# Altium schematic sheet Sheet2.SchDoc
size 420 x 297 mm; Razrabotal: {Разработал}; Prov: {Проверил}; Tkont: {Т. конт.}; Nkont: {Н. конт.}; Utv: {Утвердил}; Naimenovanie: {Наименование}; Oboznachenie: {Обозначение}; Shifr: {Шифр}
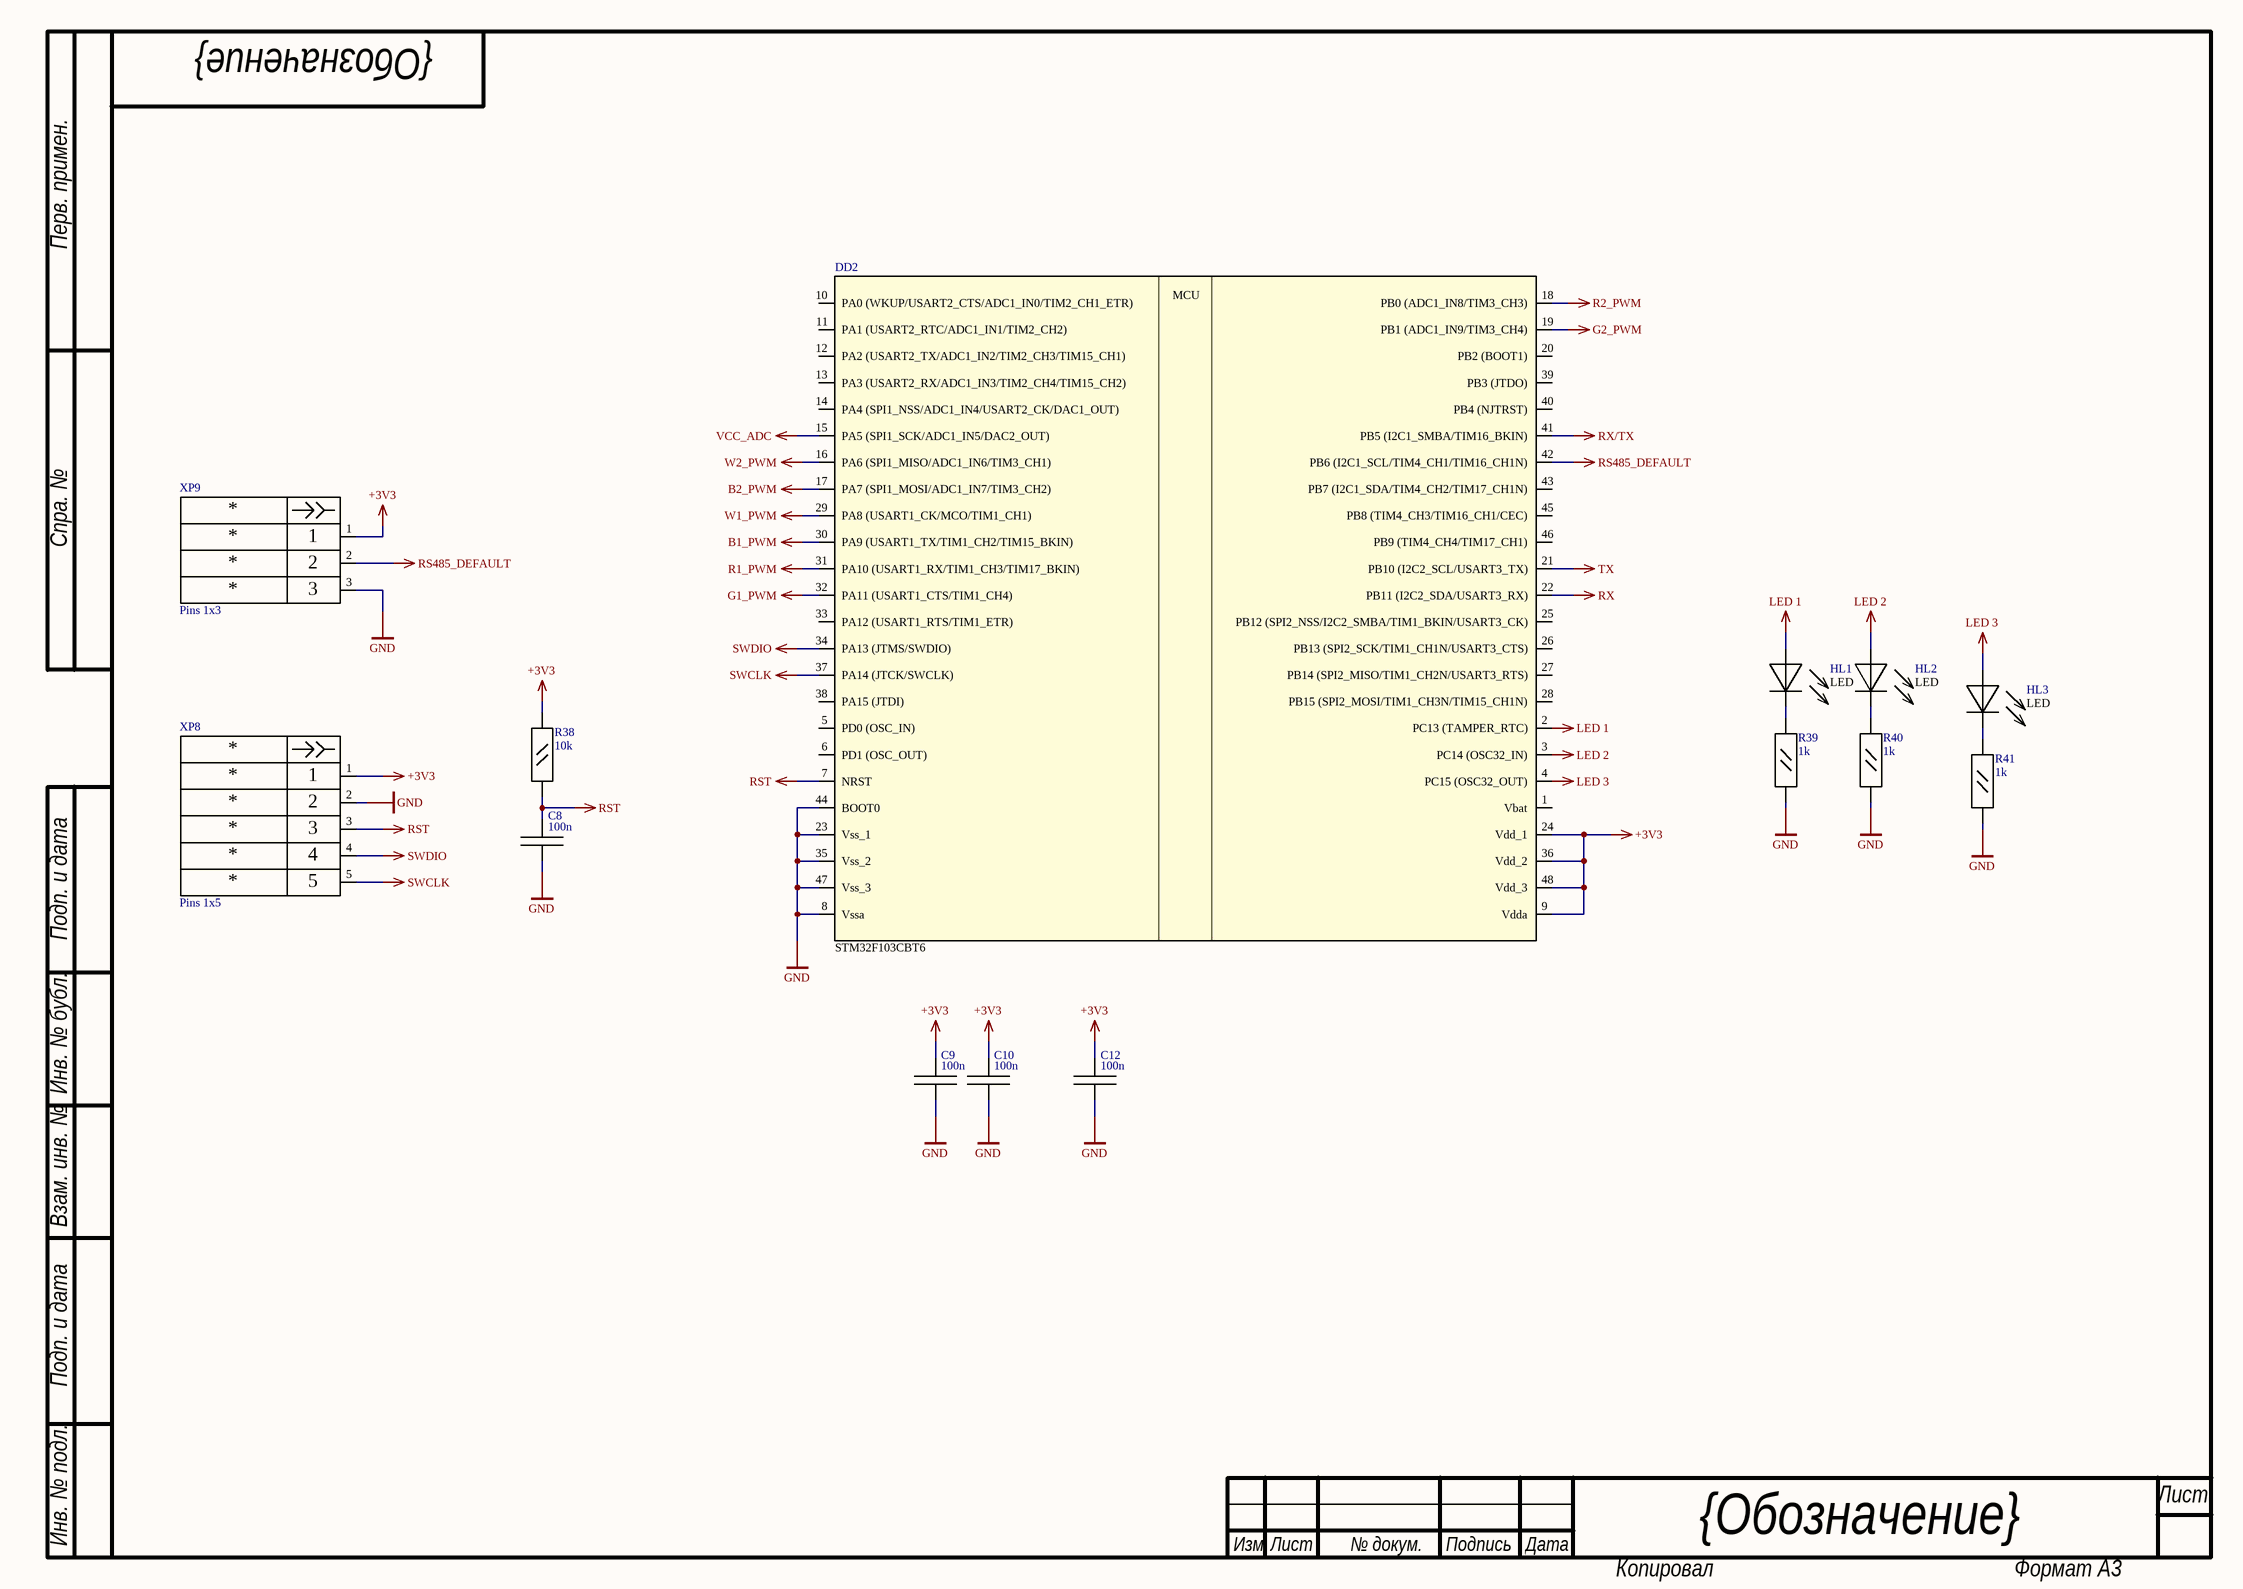
[diagram p0: Sheet2.SchDoc]

## Parts
C8  100n  [Cap Ceramic 0805]
C9  100n  [Cap Ceramic 0805]
C10  100n  [Cap Ceramic 0805]
C12  100n  [Cap Ceramic 0805]
DD2  STM32F103CBT6  [TQFP48 S0.5]
HL1  LED  [LED 0805]
HL2  LED  [LED 0805]
HL3  LED  [LED 0805]
R38  10k  [Resistor 0805]
R39  1k  [Resistor 0805]
R40  1k  [Resistor 0805]
R41  1k  [Resistor 0805]
XP8  Pins 1x5  [Pins 1x5]
XP9  Pins 1x3  [Pins 1x3]

## Nets
+3V3: C9.2 C10.2 C12.2 DD2.9(Vdda) DD2.24(Vdd_1) DD2.36(Vdd_2) DD2.48(Vdd_3) R38.1 XP8.1 XP9.1
B1_PWM: DD2.30(PA9_(USART1_TX/TIM1_CH2/TIM15_BKIN))
B2_PWM: DD2.17(PA7_(SPI1_MOSI/ADC1_IN7/TIM3_CH2))
G1_PWM: DD2.32(PA11_(USART1_CTS/TIM1_CH4))
G2_PWM: DD2.19(PB1_(ADC1_IN9/TIM3_CH4))
GND: C8.1 C9.1 C10.1 C12.1 DD2.8(Vssa) DD2.23(Vss_1) DD2.35(Vss_2) DD2.44(BOOT0) DD2.47(Vss_3) R39.2 R40.2 R41.2 XP8.2 XP9.3
LED 1: DD2.2(PC13_(TAMPER_RTC)) HL1.1(A)
LED 2: DD2.3(PC14_(OSC32_IN)) HL2.1(A)
LED 3: DD2.4(PC15_(OSC32_OUT)) HL3.1(A)
R1_PWM: DD2.31(PA10_(USART1_RX/TIM1_CH3/TIM17_BKIN))
R2_PWM: DD2.18(PB0_(ADC1_IN8/TIM3_CH3))
RS485_DEFAULT: DD2.42(PB6_(I2C1_SCL/TIM4_CH1/TIM16_CH1N)) XP9.2
RST: C8.2 DD2.7(NRST) R38.2 XP8.3
RX: DD2.22(PB11_(I2C2_SDA/USART3_RX))
RX/TX: DD2.41(PB5_(I2C1_SMBA/TIM16_BKIN))
SWCLK: DD2.37(PA14_(JTCK/SWCLK)) XP8.5
SWDIO: DD2.34(PA13_(JTMS/SWDIO)) XP8.4
TX: DD2.21(PB10_(I2C2_SCL/USART3_TX))
VCC_ADC: DD2.15(PA5_(SPI1_SCK/ADC1_IN5/DAC2_OUT))
W1_PWM: DD2.29(PA8_(USART1_CK/MCO/TIM1_CH1))
W2_PWM: DD2.16(PA6_(SPI1_MISO/ADC1_IN6/TIM3_CH1))
NetHL1_2: HL1.2(K) R39.1
NetHL2_2: HL2.2(K) R40.1
NetHL3_2: HL3.2(K) R41.1

Not connected (* = marked no-connect by the designer): DD2 1(Vbat) 5(PD0_(OSC_IN)) 6(PD1_(OSC_OUT)) 10(PA0_(WKUP/USART2_CTS/ADC1_IN0/TIM2_CH1_ETR)) 11(PA1_(USART2_RTC/ADC1_IN1/TIM2_CH2)) 12(PA2_(USART2_TX/ADC1_IN2/TIM2_CH3/TIM15_CH1)) 13(PA3_(USART2_RX/ADC1_IN3/TIM2_CH4/TIM15_CH2)) 14(PA4_(SPI1_NSS/ADC1_IN4/USART2_CK/DAC1_OUT)) 20(PB2_(BOOT1)) 25(PB12_(SPI2_NSS/I2C2_SMBA/TIM1_BKIN/USART3_CK)) 26(PB13_(SPI2_SCK/TIM1_CH1N/USART3_CTS)) 27(PB14_(SPI2_MISO/TIM1_CH2N/USART3_RTS)) 28(PB15_(SPI2_MOSI/TIM1_CH3N/TIM15_CH1N)) 33(PA12_(USART1_RTS/TIM1_ETR)) 38(PA15_(JTDI)) 39(PB3_(JTDO)) 40(PB4_(NJTRST)) 43(PB7_(I2C1_SDA/TIM4_CH2/TIM17_CH1N)) 45(PB8_(TIM4_CH3/TIM16_CH1/CEC)) 46(PB9_(TIM4_CH4/TIM17_CH1))

## Notes on the sheet
- Перв. примен.
- Спра. №
- Подп. и дата
- Инв. № бубл.
- Взам. инв. №
- Инв. № подл.
- Лист
- Изм
- № докум.
- Подпись
- Дата
- Копировал
- Формат А3
- (in symbol STM32F100C4T6) MCU

## Library data of the parts
C8-C10 C12 = CerCap: Comments: *
DD2 = STM32F100C4T6
R38-R41 = Resistor 0,125W: Comments: *
HL1-HL3 = LED: Comments: *
XP8 = Pins 1x5: Comments: *; Name1: *; Name: *; Name2: *; Name3: *; Name4: *; Name5: *
XP9 = Pins 1x3: Comments: *; Name1: *; Name: *; Name2: *; Name3: *